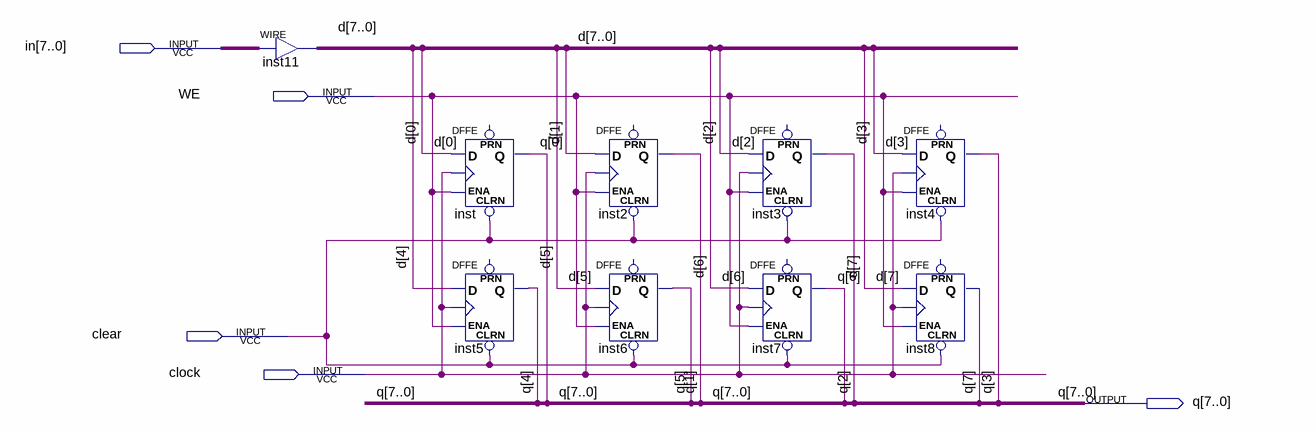
[diagram p0: schematic sheet]
// Quartus schematic reg8bit.bdf as structural Verilog: 9 symbols, 5 pins
module reg8bit (
  input  [7:0] in,
  input  WE,
  input  clear,
  input  clock,
  output [7:0] q
);

  wire [7:0] d;

  assign d = in;  // WIRE inst11
  DFFE inst (.CLRN(clear), .D(d[0]), .CLK(clock), .ENA(WE), .Q(q[0]));  // open: PRN
  DFFE inst5 (.CLRN(clear), .D(d[4]), .CLK(clock), .ENA(WE), .Q(q[4]));  // open: PRN
  DFFE inst2 (.CLRN(clear), .D(d[1]), .CLK(clock), .ENA(WE), .Q(q[1]));  // open: PRN
  DFFE inst6 (.CLRN(clear), .D(d[5]), .CLK(clock), .ENA(WE), .Q(q[5]));  // open: PRN
  DFFE inst3 (.CLRN(clear), .D(d[2]), .CLK(clock), .ENA(WE), .Q(q[2]));  // open: PRN
  DFFE inst7 (.CLRN(clear), .D(d[6]), .CLK(clock), .ENA(WE), .Q(q[6]));  // open: PRN
  DFFE inst4 (.CLRN(clear), .D(d[3]), .CLK(clock), .ENA(WE), .Q(q[3]));  // open: PRN
  DFFE inst8 (.CLRN(clear), .D(d[7]), .CLK(clock), .ENA(WE), .Q(q[7]));  // open: PRN
endmodule
